# EAGLE design 24bit_color (EAGLE 7.4.0)
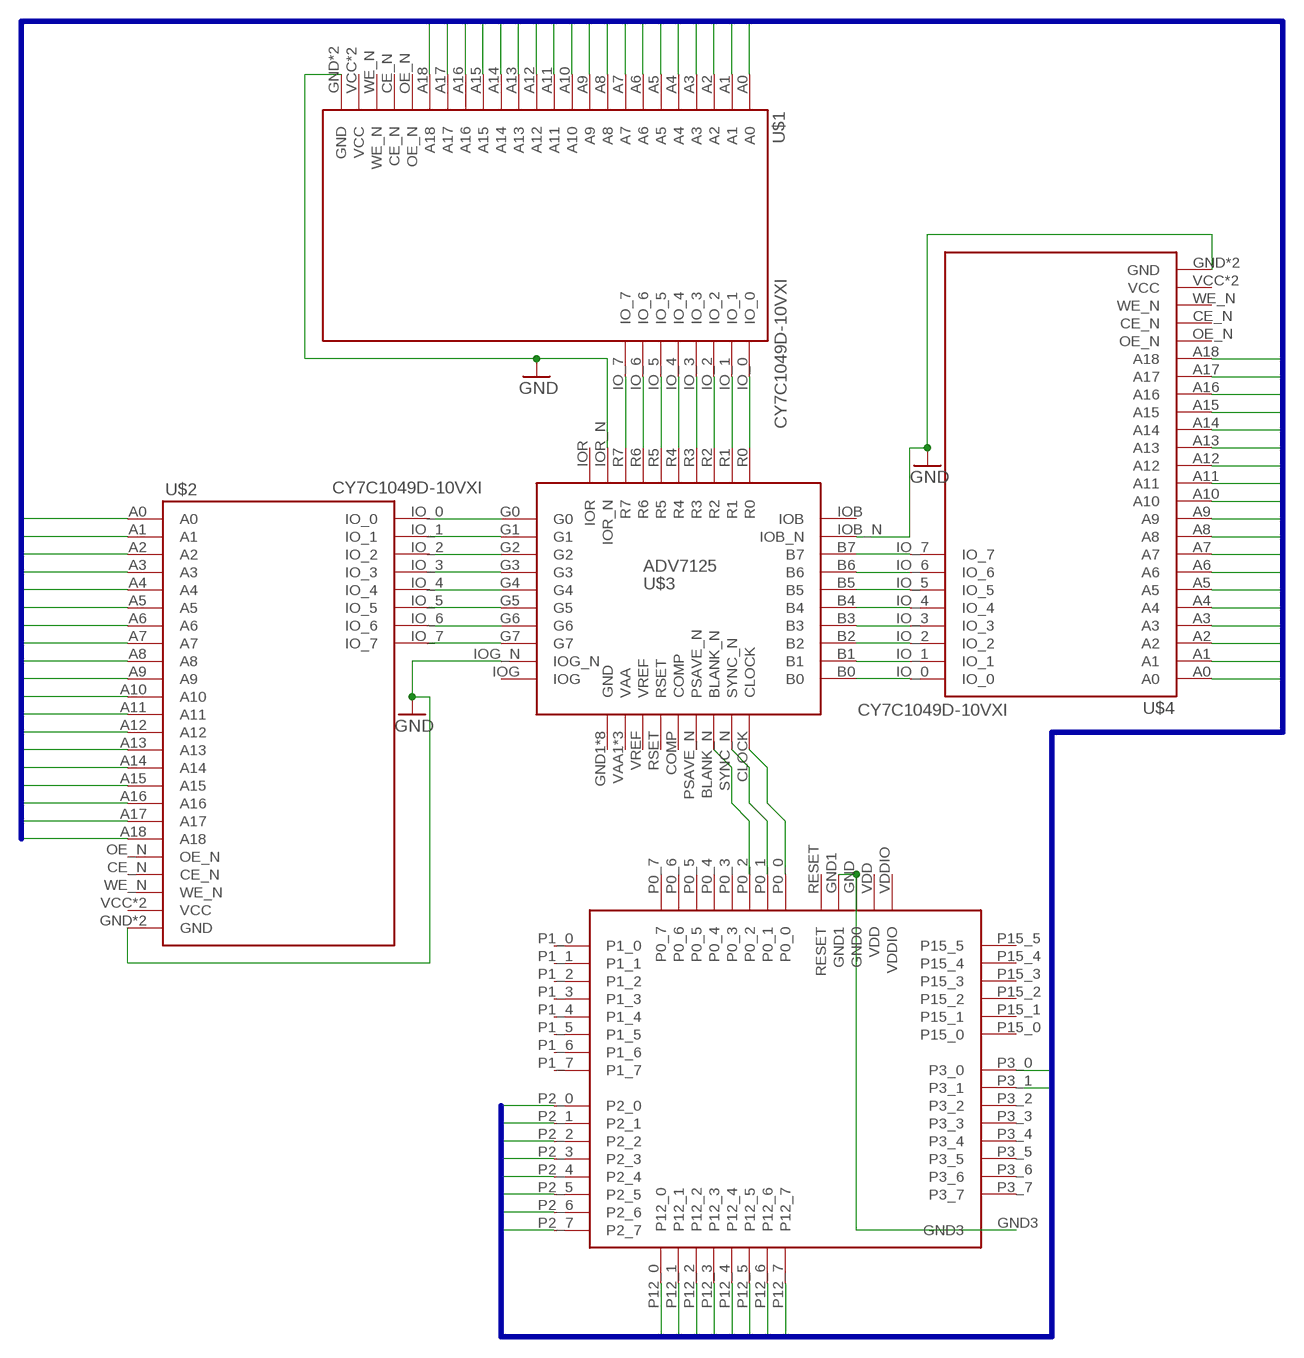
[diagram p0: schematic, sheet 1]

## Parts
U$1  CY7C1049D-10VXI  [SOJ36]
U$2  CY7C1049D-10VXI  [SOJ36]
U$3  ADV7125  [LQFP48]
U$4  CY7C1049D-10VXI  [SOJ36]
U$5  CY8CKIT-059  [PSOC_STICK]

## Nets
ADR0: U$1.A0 U$2.A0 U$4.A0 U$5.P2_0
ADR1: U$1.A1 U$2.A1 U$4.A1 U$5.P2_1
ADR2: U$1.A2 U$2.A2 U$4.A2 U$5.P2_2
ADR3: U$1.A3 U$2.A3 U$4.A3 U$5.P2_3
ADR4: U$1.A4 U$2.A4 U$4.A4 U$5.P2_4
ADR5: U$1.A5 U$2.A5 U$4.A5 U$5.P2_5
ADR6: U$1.A6 U$2.A6 U$4.A6 U$5.P2_6
ADR7: U$1.A7 U$2.A7 U$4.A7 U$5.P2_7
ADR8: U$1.A8 U$2.A8 U$4.A8 U$5.P12_0
ADR9: U$1.A9 U$2.A9 U$4.A9 U$5.P12_1
ADR10: U$1.A10 U$2.A10 U$4.A10 U$5.P12_2
ADR11: U$1.A11 U$2.A11 U$4.A11 U$5.P12_3
ADR12: U$1.A12 U$2.A12 U$4.A12 U$5.P12_4
ADR13: U$1.A13 U$2.A13 U$4.A13 U$5.P12_5
ADR14: U$1.A14 U$2.A14 U$4.A14 U$5.P12_6
ADR15: U$1.A15 U$2.A15 U$4.A15 U$5.P12_7
ADR16: U$1.A16 U$2.A16 U$4.A16 U$5.P3_0
ADR17: U$1.A17 U$2.A17 U$4.A17 U$5.P3_1
ADR18: U$1.A18 U$2.A18 U$4.A18
GND: U$1.GND U$1.GND_(GND) U$2.GND U$2.GND_(GND) U$3.IOB_N U$3.IOG_N U$3.IOR_N U$4.GND U$4.GND_(GND)
N$1: U$2.IO_0 U$3.G0
N$2: U$2.IO_1 U$3.G1
N$3: U$2.IO_2 U$3.G2
N$4: U$2.IO_3 U$3.G3
N$5: U$2.IO_4 U$3.G4
N$6: U$2.IO_5 U$3.G5
N$7: U$2.IO_6 U$3.G6
N$8: U$2.IO_7 U$3.G7
N$9: U$1.IO_0 U$3.R0
N$10: U$1.IO_1 U$3.R1
N$11: U$1.IO_2 U$3.R2
N$12: U$1.IO_3 U$3.R3
N$13: U$1.IO_4 U$3.R4
N$14: U$1.IO_5 U$3.R5
N$15: U$1.IO_6 U$3.R6
N$16: U$1.IO_7 U$3.R7
N$17: U$3.B7 U$4.IO_7
N$18: U$3.B6 U$4.IO_6
N$19: U$3.B5 U$4.IO_5
N$20: U$3.B4 U$4.IO_4
N$21: U$3.B3 U$4.IO_3
N$22: U$3.B2 U$4.IO_2
N$23: U$3.B1 U$4.IO_1
N$24: U$3.B0 U$4.IO_0
N$25: U$3.CLOCK U$5.P0_0
N$26: U$5.GND1 U$5.GND3 U$5.GND(GND0)
N$27: U$3.SYNC_N U$5.P0_1
N$28: U$3.BLANK_N U$5.P0_2
Unconnected: U$1.CE_N U$1.OE_N U$1.WE_N U$2.CE_N U$2.OE_N U$2.WE_N U$3.COMP U$3.IOB U$3.IOG U$3.IOR U$3.PSAVE_N U$3.RSET U$3.VREF U$4.CE_N U$4.OE_N U$4.WE_N U$5.P0_3 U$5.P0_4 U$5.P0_5 U$5.P0_6 U$5.P0_7 U$5.P1_0 U$5.P1_1 U$5.P1_2 U$5.P1_3 U$5.P1_4 U$5.P1_5 U$5.P1_6 U$5.P1_7 U$5.P3_2 U$5.P3_3 U$5.P3_4 U$5.P3_5 U$5.P3_6 U$5.P3_7 U$5.P15_0 U$5.P15_1 U$5.P15_2 U$5.P15_3 U$5.P15_4 U$5.P15_5 U$5.RESET

## Buses
ADR[0..18]

## Power pins joined to a net without a drawn wire
GND: U$3.GND1(GND) U$3.GND2(GND) U$3.GND3(GND) U$3.GND4(GND) U$3.GND5(GND) U$3.GND6(GND) U$3.GND7(GND) U$3.GND8(GND)
VAA: U$3.VAA1(VAA) U$3.VAA2(VAA) U$3.VAA3(VAA)
VCC: U$1.VCC U$1.VCC_(VCC) U$2.VCC U$2.VCC_(VCC) U$4.VCC U$4.VCC_(VCC)
VDD: U$5.VDD
VDDIO: U$5.VDDIO

## Library data of the parts
U$1 U$2 U$4 = CY8C5888LTI-LP097:CY7C1049D-10VXI
U$3 = adv7125:ADV7125: Analog Devices Video DAC 3 Channel (RGB) with active low sync and blank
U$5 = CY8C5888LTI-LP097:CY8CKIT-059

## Net classes
0 default: width 0.152 mm, drill 0.33 mm, clearance 0.152 mm

## Board
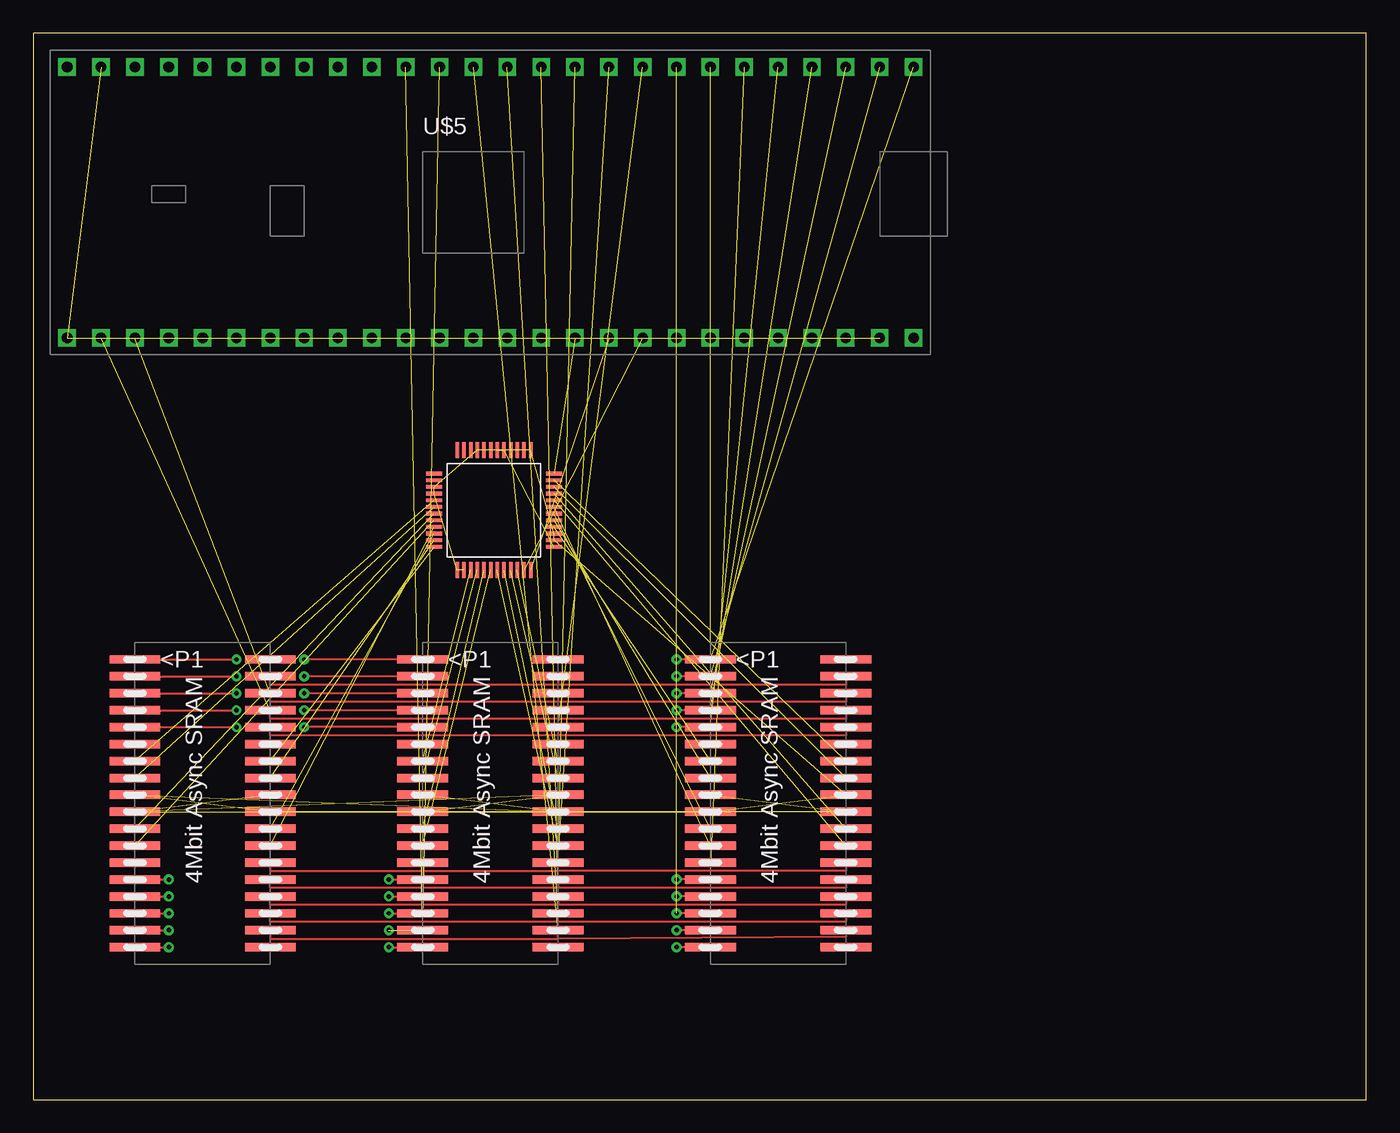
[diagram p1: board, top side]
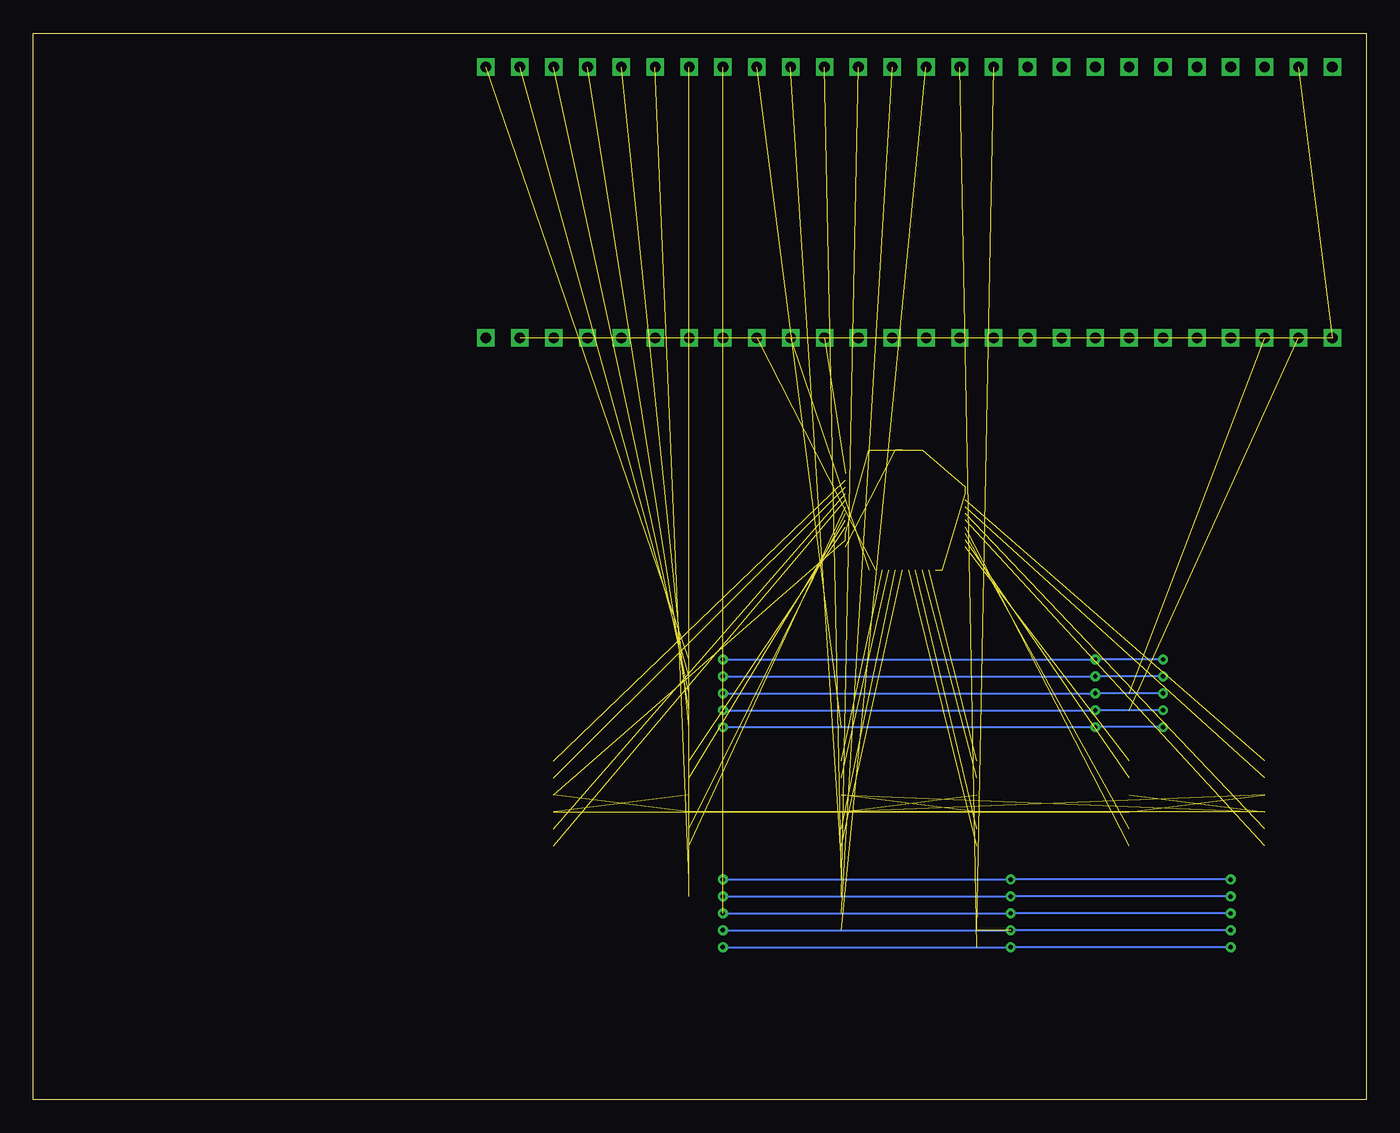
[diagram p2: board, bottom side, seen from below]

Size 100 x 80 mm. Coordinates in mm from the lower left corner, seen from the top.
Outline: 0,0 100,0 100,80 0,80 0,0
Copper layers (1*16): Top 0.035mm / dielectric 1.5mm / Bottom 0.035mm
Design rules "default": minimum track width 10mil, minimum drill 24mil, track to track 8mil, track to pad 8mil, pad to pad 8mil, via to via 8mil, smd to smd 8mil, copper to edge 40mil, drill to drill 8mil, minimum pad ring 10mil, minimum via ring 8mil, stop-mask expansion 4mil, vias tented up to drill 0mil, thermal gap 10mil

### Footprints (pad centres in the part's own frame; a part is rotated, then mirrored left to right if it is on the bottom)
SOJ36 = smd 3.81 x 0.635: A0 1.27,22.86; A1 1.27,21.59; A2 1.27,20.32; A3 1.27,19.05; A4 1.27,17.78; A5 1.27,6.35; A6 1.27,5.08; A7 1.27,3.81; A8 1.27,2.54; A9 1.27,1.27; A10 11.43,2.54; A11 11.43,3.81; A12 11.43,5.08; A13 11.43,6.35; A14 11.43,7.62; A15 11.43,17.78; A16 11.43,19.05; A17 11.43,20.32; A18 11.43,21.59; CE_N 1.27,16.51; GND 1.27,11.43; GND_ 11.43,12.7; IO_0 1.27,15.24; IO_1 1.27,13.97; IO_2 1.27,10.16; IO_3 1.27,8.89; IO_4 11.43,8.89; IO_5 11.43,10.16; IO_6 11.43,13.97; IO_7 11.43,15.24; NC 11.43,22.86; NC_ 11.43,1.27; OE_N 11.43,16.51; VCC 1.27,12.7; VCC_ 11.43,11.43; WE_N 1.27,7.62
LQFP48 = smd 0.27 x 1.2: B0 -2.75,-3.5; B1 -2.25,-3.5; B2 -1.75,-3.5; B3 -1.25,-3.5; B4 -0.75,-3.5; B5 -0.25,-3.5; B6 0.25,-3.5; B7 0.75,-3.5; CLOCK 1.25,-3.5; GND3 -3.75,-3.5; GND4 -3.25,-3.5; GND7 0.25,5.5; GND8 -0.25,5.5; PSAVE_N 0.75,5.5; R0 -0.75,5.5; R1 -1.25,5.5; R2 -1.75,5.5; R3 -2.25,5.5; R4 -2.75,5.5; R5 -3.25,5.5; R6 -3.75,5.5; R7 -4.25,5.5; RSET 1.25,5.5; VAA1 -4.25,-3.5 | smd 1.2 x 0.27: BLANK_N -6,-1.25; COMP 3,3.25; G0 -6,2.75; G1 -6,2.25; G2 -6,1.75; G3 -6,1.25; G4 -6,0.75; G5 -6,0.25; G6 -6,-0.25; G7 -6,-0.75; GND1 -6,3.75; GND2 -6,3.25; GND5 3,-1.75; GND6 3,-1.25; IOB 3,-0.25; IOB_N 3,-0.75; IOG 3,1.75; IOG_N 3,1.25; IOR 3,2.75; IOR_N 3,2.25; SYNC_N -6,-1.75; VAA2 3,0.25; VAA3 3,0.75; VREF 3,3.75
PSOC_STICK = drill 0.8 square: GND 2.54,20.32; GND1 60.96,0; GND3 0,0; P0_0 38.1,0; P0_1 40.64,0; P0_2 43.18,0; P0_3 45.72,0; P0_4 48.26,0; P0_5 50.8,0; P0_6 53.34,0; P0_7 55.88,0; P1_0 22.86,20.32; P1_1 20.32,20.32; P1_2 17.78,20.32; P1_3 15.24,20.32; P1_4 12.7,20.32; P1_5 10.16,20.32; P1_6 7.62,20.32; P1_7 5.08,20.32; P2_0 63.5,20.32; P2_1 60.96,20.32; P2_2 58.42,20.32; P2_3 55.88,20.32; P2_4 53.34,20.32; P2_5 50.8,20.32; P2_6 48.26,20.32; P2_7 45.72,20.32; P3_0 2.54,0; P3_1 5.08,0; P3_2 7.62,0; P3_3 10.16,0; P3_4 12.7,0; P3_5 15.24,0; P3_6 17.78,0; P3_7 20.32,0; P12_0 25.4,20.32; P12_1 27.94,20.32; P12_2 30.48,20.32; P12_3 33.02,20.32; P12_4 35.56,20.32; P12_5 38.1,20.32; P12_6 40.64,20.32; P12_7 43.18,20.32; P15_0 22.86,0; P15_1 25.4,0; P15_2 27.94,0; P15_3 30.48,0; P15_4 33.02,0; P15_5 35.56,0; RESET 58.42,0; VDD 63.5,0; VDDIO 0,20.32

### Placement (x,y rotation side)
U$1  6.35,10.16 0 top
U$2  27.94,10.16 0 top
U$3  35.56,45.72 90 top
U$4  49.53,10.16 0 top
U$5  2.54,57.15 0 top

### Tracks (layer width: path | path; a pad name or v marks a point on that pad's centre or on a via)
ADR0  (via drill 0.33)  (1 unrouted)
  Top 0.152: U$1.A0 v15.24,33.02 | U$2.A0 v20.32,33.02 | U$4.A0 v48.26,33.02
  Bottom 0.152: v15.24,33.02 v20.32,33.02 v48.26,33.02
ADR1  (via drill 0.33)  (1 unrouted)
  Top 0.152: U$1.A1 v15.24,31.75 | U$4.A1 v48.26,31.75 | U$2.A1 v20.32,31.75
  Bottom 0.152: v15.24,31.75 v20.32,31.75 v48.26,31.75
ADR2  (via drill 0.33)  (1 unrouted)
  Top 0.152: U$1.A2 v15.24,30.48 | U$4.A2 v48.26,30.48 | U$2.A2 v20.32,30.48
  Bottom 0.152: v15.24,30.48 v20.32,30.48 v48.26,30.48
ADR3  (via drill 0.33)  (1 unrouted)
  Top 0.152: U$1.A3 v15.24,29.21 | U$4.A3 v48.26,29.21 | U$2.A3 v20.32,29.21
  Bottom 0.152: v15.24,29.21 v20.32,29.21 v48.26,29.21
ADR4  (via drill 0.33)  (1 unrouted)
  Top 0.152: U$1.A4 v15.24,27.94 | U$4.A4 v48.26,27.94 | U$2.A4 v20.32,27.94
  Bottom 0.152: v15.24,27.94 v20.32,27.94 v48.26,27.94
ADR5  (via drill 0.33)  (1 unrouted)
  Top 0.152: U$1.A5 v10.16,16.51 | v26.67,16.51 U$2.A5 | U$4.A5 v48.26,16.51
  Bottom 0.152: v10.16,16.51 v26.67,16.51 v48.26,16.51
ADR6  (via drill 0.33)  (1 unrouted)
  Top 0.152: U$1.A6 v10.16,15.24 | v26.67,15.24 U$2.A6 | U$4.A6 v48.26,15.24
  Bottom 0.152: v10.16,15.24 v26.67,15.24 v48.26,15.24
ADR7  (via drill 0.33)  (1 unrouted)
  Top 0.152: U$1.A7 v10.16,13.97 | v26.67,13.97 U$2.A7 | U$4.A7 v48.26,13.97
  Bottom 0.152: v10.16,13.97 v26.67,13.97 v48.26,13.97
ADR8  (via drill 0.33)  (2 unrouted)
  Top 0.152: U$1.A8 v10.16,12.7 | U$4.A8 v48.26,12.7
  Bottom 0.152: v10.16,12.7 v26.67,12.7 v48.26,12.7
ADR9  (via drill 0.33)  (1 unrouted)
  Top 0.152: U$1.A9 v10.16,11.43 | v26.67,11.43 U$2.A9 | U$4.A9 v48.26,11.43
  Bottom 0.152: v10.16,11.43 v26.67,11.43 v48.26,11.43
ADR10  (1 unrouted)
  Top 0.152: U$1.A10 17.78,12.06 39.37,12.06 | 39.37,12.06 U$2.A10 | U$4.A10 60.96,12.19 39.37,12.06
ADR11  (1 unrouted)
  Top 0.152: U$4.A11 60.96,13.34 39.37,13.34 | 39.37,13.34 U$2.A11 | 39.37,13.34 17.78,13.34 U$1.A11
ADR12  (1 unrouted)
  Top 0.152: U$4.A12 60.96,14.61 39.37,14.61 | U$2.A12 39.37,14.61 | 39.37,14.61 17.78,14.61 U$1.A12
ADR13  (1 unrouted)
  Top 0.152: U$2.A13 39.37,15.88 | 39.37,15.88 17.78,15.88 U$1.A13 | U$4.A13 60.96,15.88 39.37,15.88
ADR14  (1 unrouted)
  Top 0.152: U$1.A14 17.78,17.14 39.37,17.14 | 39.37,17.14 U$2.A14 | U$4.A14 60.96,17.14 39.37,17.14
ADR15  (1 unrouted)
  Top 0.152: U$2.A15 39.37,27.3 | 39.37,27.3 17.78,27.3 U$1.A15 | U$4.A15 60.96,27.3 39.37,27.3
ADR16  (1 unrouted)
  Top 0.152: U$2.A16 39.37,28.57 | 39.37,28.57 17.78,28.57 U$1.A16 | U$4.A16 60.96,28.57 39.37,28.57
ADR17  (1 unrouted)
  Top 0.152: U$2.A17 39.37,29.84 | 39.37,29.84 17.78,29.84 U$1.A17 | U$4.A17 60.96,29.84 39.37,29.84
ADR18
  Top 0.152: U$2.A18 39.37,31.11 | 39.37,31.11 17.78,31.11 U$1.A18 | U$4.A18 60.96,31.11 39.37,31.11
GND  (16 unrouted)
N$1  (1 unrouted)
N$2  (1 unrouted)
N$3  (1 unrouted)
N$4  (1 unrouted)
N$5  (1 unrouted)
N$6  (1 unrouted)
N$7  (1 unrouted)
N$8  (1 unrouted)
N$9  (1 unrouted)
N$10  (1 unrouted)
N$11  (1 unrouted)
N$12  (1 unrouted)
N$13  (1 unrouted)
N$14  (1 unrouted)
N$15  (1 unrouted)
N$16  (1 unrouted)
N$17  (1 unrouted)
N$18  (1 unrouted)
N$19  (1 unrouted)
N$20  (1 unrouted)
N$21  (1 unrouted)
N$22  (1 unrouted)
N$23  (1 unrouted)
N$24  (1 unrouted)
N$25  (1 unrouted)
N$26  (2 unrouted)
N$27  (1 unrouted)
N$28  (1 unrouted)
VAA  (2 unrouted)
VCC  (5 unrouted)